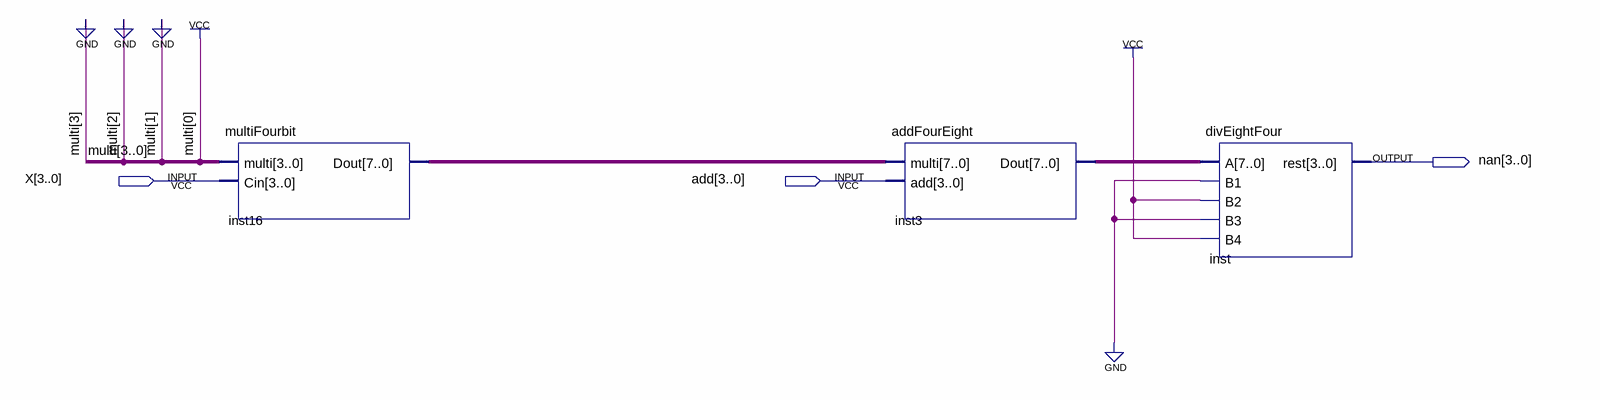
[diagram p0: schematic sheet]
// Quartus schematic nansu_m.bdf as structural Verilog: 3 symbols, 3 pins
module nansu_m (
  input  [3:0] X,
  input  [3:0] add,
  output [3:0] nan
);

  wire [7:0] inst3_dout, inst16_dout;

  multiFourbit inst16 (.multi(4'b0001), .Cin(X), .Dout(inst16_dout));
  addFourEight inst3 (.multi(inst16_dout), .add(add), .Dout(inst3_dout));
  divEightFour inst (.A(inst3_dout), .B1(1'b0), .B2(1'b1), .B3(1'b0), .B4(1'b1), .rest(nan));
endmodule
